# Altium schematic sheet Translators.SchDoc: FMC_ADC
size 420 x 297 mm; Author: G.Kasprowicz; CompanyName: WUT ISE; DrawnBy: G.Kasprowicz; Organization: WUT ISE; Address1: PW ISE; Address2: Nowowiejska 15/19 00-665 Warsaw; Address3: gkasprow@gmail.com; Revision: 2; SheetNumber: -; SheetTotal: -; ModifiedBy: -; CheckedDate: -; Title2: 100M_10B_16CHA_TDC; DivGrp: WUT ISE; Designer: G.Kasprowicz; ModifiedDate: -; ProjectName: Sensor Box
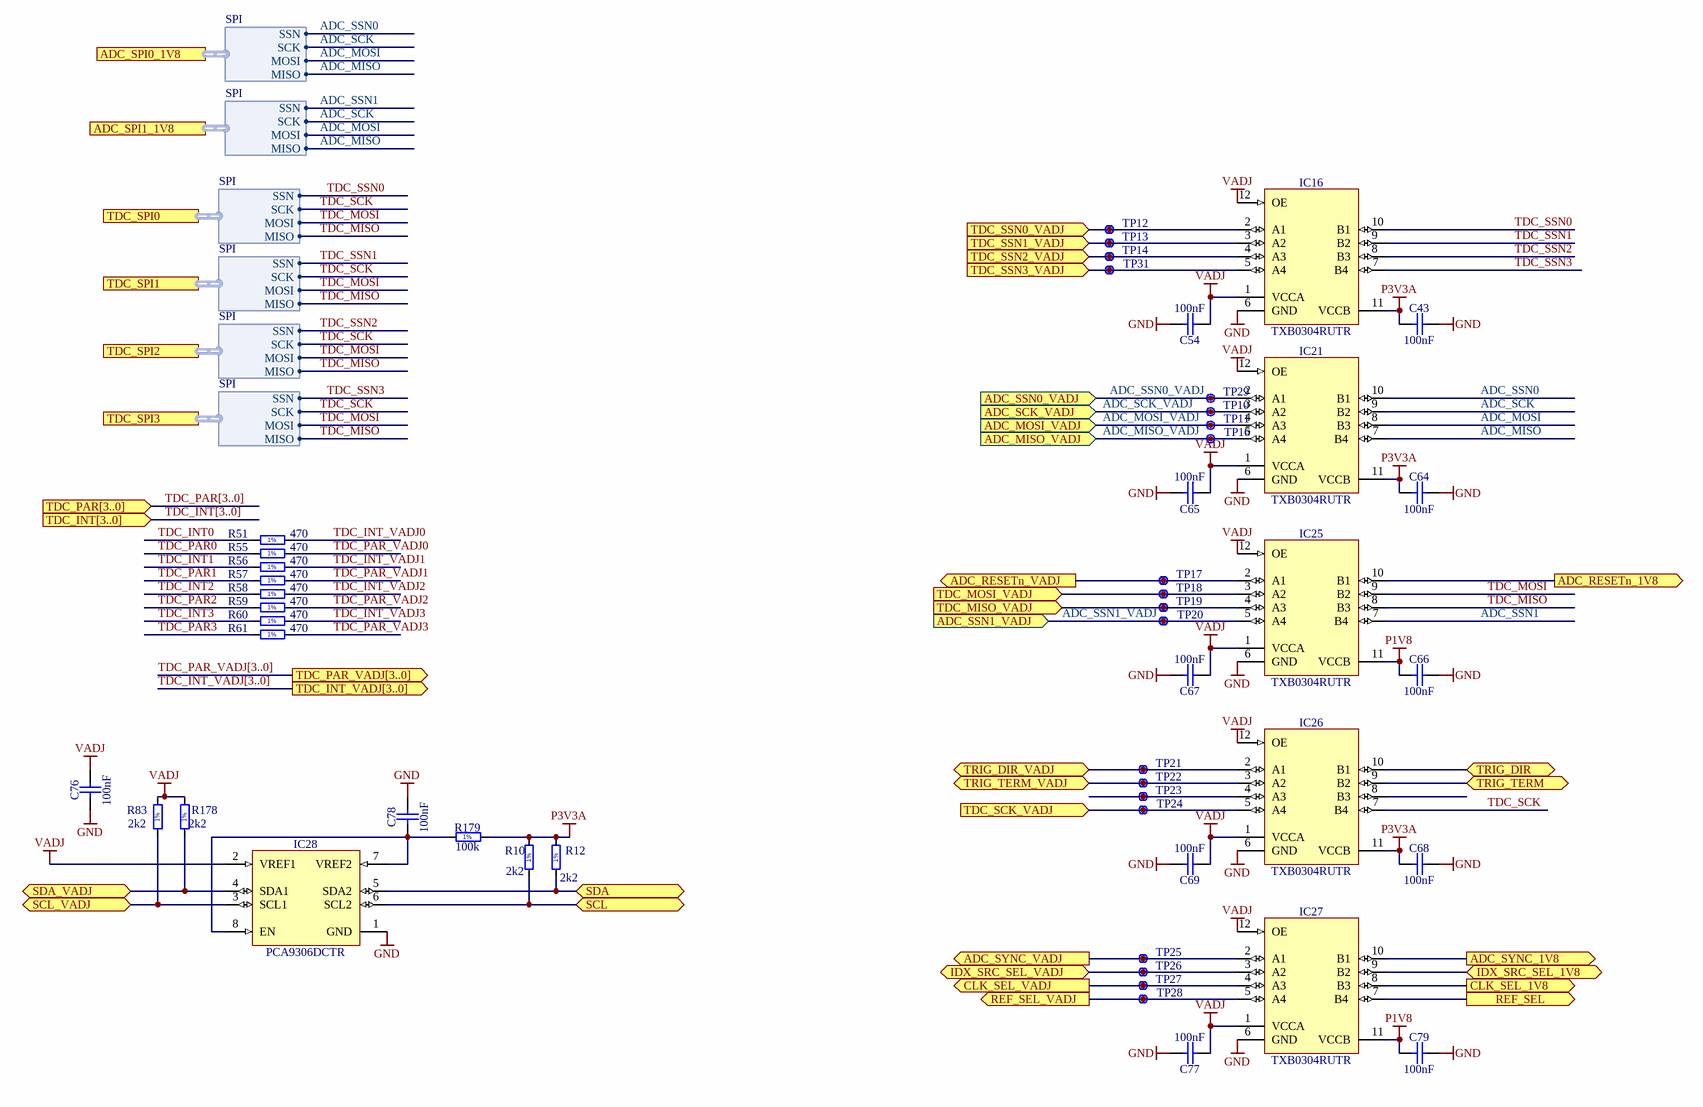
[diagram p0: Translators.SchDoc]

## Parts
C43  100nF  [CAPC0603X33N]
C54  100nF  [CAPC0603X33N]
C64  100nF  [CAPC0603X33N]
C65  100nF  [CAPC0603X33N]
C66  100nF  [CAPC0603X33N]
C67  100nF  [CAPC0603X33N]
C68  100nF  [CAPC0603X33N]
C69  100nF  [CAPC0603X33N]
C76  100nF  [CAPC0603X33N]
C77  100nF  [CAPC0603X33N]
C78  100nF  [CAPC0603X33N]
C79  100nF  [CAPC0603X33N]
IC16  TXB0304RUTR  [TEXAS_RUT (R-PUQFN-N12)]
IC21  TXB0304RUTR  [TEXAS_RUT (R-PUQFN-N12)]
IC25  TXB0304RUTR  [TEXAS_RUT (R-PUQFN-N12)]
IC26  TXB0304RUTR  [TEXAS_RUT (R-PUQFN-N12)]
IC27  TXB0304RUTR  [TEXAS_RUT (R-PUQFN-N12)]
IC28  PCA9306DCTR  [SOP65P400X130-8N]
R10  2k2  [RESC1005X40N]
R12  2k2  [RESC1005X40N]
R51  470  [RESC1005X40N]
R55  470  [RESC1005X40N]
R56  470  [RESC1005X40N]
R57  470  [RESC1005X40N]
R58  470  [RESC1005X40N]
R59  470  [RESC1005X40N]
R60  470  [RESC1005X40N]
R61  470  [RESC1005X40N]
R83  2k2  [RESC1005X40N]
R178  2k2  [RESC1005X40N]
R179  100k  [RESC1005X40N]
TP10  Test Point  [TPS62]  (value not drawn)
TP11  Test Point  [TPS62]  (value not drawn)
TP12  Test Point  [TPS62]  (value not drawn)
TP13  Test Point  [TPS62]  (value not drawn)
TP14  Test Point  [TPS62]  (value not drawn)
TP16  Test Point  [TPS62]  (value not drawn)
TP17  Test Point  [TPS62]  (value not drawn)
TP18  Test Point  [TPS62]  (value not drawn)
TP19  Test Point  [TPS62]  (value not drawn)
TP20  Test Point  [TPS62]  (value not drawn)
TP21  Test Point  [TPS62]  (value not drawn)
TP22  Test Point  [TPS62]  (value not drawn)
TP23  Test Point  [TPS62]  (value not drawn)
TP24  Test Point  [TPS62]  (value not drawn)
TP25  Test Point  [TPS62]  (value not drawn)
TP26  Test Point  [TPS62]  (value not drawn)
TP27  Test Point  [TPS62]  (value not drawn)
TP28  Test Point  [TPS62]  (value not drawn)
TP29  Test Point  [TPS62]  (value not drawn)
TP31  Test Point  [TPS62]  (value not drawn)

## Ports
ADC_MISO_VADJ (in), ADC_MOSI_VADJ (in), ADC_RESETn_1V8 (out), ADC_RESETn_VADJ (out), ADC_SCK_VADJ (in), ADC_SPI0_1V8 (harness SPI), ADC_SPI1_1V8 (harness SPI), ADC_SSN0_VADJ (in), ADC_SSN1_VADJ (in), ADC_SYNC_1V8 (out), ADC_SYNC_VADJ (out), CLK_SEL_1V8 (out), CLK_SEL_VADJ (out), IDX_SRC_SEL_1V8 (bidir), IDX_SRC_SEL_VADJ (bidir), REF_SEL (out), REF_SEL_VADJ (out), SCL (bidir), SCL_VADJ (bidir), SDA (bidir), SDA_VADJ (bidir), TDC_INT[3..0] (in), TDC_INT_VADJ[3..0] (out), TDC_MISO_VADJ (in), TDC_MOSI_VADJ (in), TDC_PAR[3..0] (in), TDC_PAR_VADJ[3..0] (out), TDC_SCK_VADJ (in), TDC_SPI0 (harness SPI), TDC_SPI1 (harness SPI), TDC_SPI2 (harness SPI), TDC_SPI3 (harness SPI), TDC_SSN0_VADJ (in), TDC_SSN1_VADJ (in), TDC_SSN2_VADJ (in), TDC_SSN3_VADJ (in), TRIG_DIR (bidir), TRIG_DIR_VADJ (bidir), TRIG_TERM (bidir), TRIG_TERM_VADJ (bidir)

## Harnesses
SPI: MISO, MOSI, SCK, SSN

## Nets
GND: C43.2 C54.2 C64.2 C65.2 C66.2 C67.2 C68.2 C69.2 C76.1 C77.2 C78.2 C79.2 IC16.6(GND) IC21.6(GND) IC25.6(GND) IC26.6(GND) IC27.6(GND) IC28.1(GND)
P1V8: C66.1 C79.1 IC25.11(VCCB) IC27.11(VCCB)
P3V3A: C43.1 C64.1 C68.1 IC16.11(VCCB) IC21.11(VCCB) IC26.11(VCCB) R10.2 R12.2 R179.2
VADJ: C54.1 C65.1 C67.1 C69.1 C76.2 C77.1 IC16.1(VCCA) IC16.12(OE) IC21.1(VCCA) IC21.12(OE) IC25.1(VCCA) IC25.12(OE) IC26.1(VCCA) IC26.12(OE) IC27.1(VCCA) IC27.12(OE) IC28.2(VREF1) R83.2 R178.2
ADC_MISO: IC21.7(B4) ; port ADC_SPI0_1V8.MISO, port ADC_SPI1_1V8.MISO
ADC_MISO_VADJ: IC21.5(A4) TP16.1 ; port ADC_MISO_VADJ
ADC_MOSI: IC21.8(B3) ; port ADC_SPI0_1V8.MOSI, port ADC_SPI1_1V8.MOSI
ADC_MOSI_VADJ: IC21.4(A3) TP11.1 ; port ADC_MOSI_VADJ
ADC_RESETn_1V8: IC25.10(B1) ; port ADC_RESETn_1V8
ADC_RESETn_VADJ: IC25.2(A1) TP17.1 ; port ADC_RESETn_VADJ
ADC_SCK: IC21.9(B2) ; port ADC_SPI0_1V8.SCK, port ADC_SPI1_1V8.SCK
ADC_SCK_VADJ: IC21.3(A2) TP10.1 ; port ADC_SCK_VADJ
ADC_SSN0: IC21.10(B1) ; port ADC_SPI0_1V8.SSN
ADC_SSN0_VADJ: IC21.2(A1) TP29.1 ; port ADC_SSN0_VADJ
ADC_SSN1: IC25.7(B4) ; port ADC_SPI1_1V8.SSN
ADC_SSN1_VADJ: IC25.5(A4) TP20.1 ; port ADC_SSN1_VADJ
ADC_SYNC_1V8: IC27.10(B1) ; port ADC_SYNC_1V8
ADC_SYNC_VADJ: IC27.2(A1) TP25.1 ; port ADC_SYNC_VADJ
CLK_SEL_1V8: IC27.8(B3) ; port CLK_SEL_1V8
CLK_SEL_VADJ: IC27.4(A3) TP27.1 ; port CLK_SEL_VADJ
IDX_SRC_SEL_1V8: IC27.9(B2) ; port IDX_SRC_SEL_1V8
IDX_SRC_SEL_VADJ: IC27.3(A2) TP26.1 ; port IDX_SRC_SEL_VADJ
REF_SEL: IC27.7(B4) ; port REF_SEL
REF_SEL_VADJ: IC27.5(A4) TP28.1 ; port REF_SEL_VADJ
SCL: IC28.6(SCL2) R10.1 ; port SCL
SCL_VADJ: IC28.3(SCL1) R83.1 ; port SCL_VADJ
SDA: IC28.5(SDA2) R12.1 ; port SDA
SDA_VADJ: IC28.4(SDA1) R178.1 ; port SDA_VADJ
TDC_INT0: R51.1
TDC_INT1: R56.1
TDC_INT2: R58.1
TDC_INT3: R60.1
TDC_INT_VADJ0: R51.2
TDC_INT_VADJ1: R56.2
TDC_INT_VADJ2: R58.2
TDC_INT_VADJ3: R60.2
TDC_MISO: IC25.8(B3) ; port TDC_SPI0.MISO, port TDC_SPI1.MISO, port TDC_SPI2.MISO, port TDC_SPI3.MISO
TDC_MISO_VADJ: IC25.4(A3) TP19.1 ; port TDC_MISO_VADJ
TDC_MOSI: IC25.9(B2) ; port TDC_SPI0.MOSI, port TDC_SPI1.MOSI, port TDC_SPI2.MOSI, port TDC_SPI3.MOSI
TDC_MOSI_VADJ: IC25.3(A2) TP18.1 ; port TDC_MOSI_VADJ
TDC_PAR0: R55.1
TDC_PAR1: R57.1
TDC_PAR2: R59.1
TDC_PAR3: R61.1
TDC_PAR_VADJ0: R55.2
TDC_PAR_VADJ1: R57.2
TDC_PAR_VADJ2: R59.2
TDC_PAR_VADJ3: R61.2
TDC_SCK: IC26.7(B4) ; port TDC_SPI0.SCK, port TDC_SPI1.SCK, port TDC_SPI2.SCK, port TDC_SPI3.SCK
TDC_SCK_VADJ: IC26.5(A4) TP24.1 ; port TDC_SCK_VADJ
TDC_SSN0: IC16.10(B1) ; port TDC_SPI0.SSN
TDC_SSN0_VADJ: IC16.2(A1) TP12.1 ; port TDC_SSN0_VADJ
TDC_SSN1: IC16.9(B2) ; port TDC_SPI1.SSN
TDC_SSN1_VADJ: IC16.3(A2) TP13.1 ; port TDC_SSN1_VADJ
TDC_SSN2: IC16.8(B3) ; port TDC_SPI2.SSN
TDC_SSN2_VADJ: IC16.4(A3) TP14.1 ; port TDC_SSN2_VADJ
TDC_SSN3: IC16.7(B4) ; port TDC_SPI3.SSN
TDC_SSN3_VADJ: IC16.5(A4) TP31.1 ; port TDC_SSN3_VADJ
TRIG_DIR: IC26.10(B1) ; port TRIG_DIR
TRIG_DIR_VADJ: IC26.2(A1) TP21.1 ; port TRIG_DIR_VADJ
TRIG_TERM: IC26.9(B2) ; port TRIG_TERM
TRIG_TERM_VADJ: IC26.3(A2) TP22.1 ; port TRIG_TERM_VADJ
NetC78_1: C78.1 IC28.7(VREF2) IC28.8(EN) R179.1
NetIC26_4: IC26.4(A3) TP23.1

Not connected (* = marked no-connect by the designer): IC26 8(B3)

## Buses and harness runs
bus TDC_INT[3..0] = port TDC_INT[3..0]
bus TDC_INT_VADJ[3..0] = port TDC_INT_VADJ[3..0]
bus TDC_PAR[3..0] = port TDC_PAR[3..0]
bus TDC_PAR_VADJ[3..0] = port TDC_PAR_VADJ[3..0]

## Notes on the sheet
- Project/Equipment
- Document
- Designer
- Drawn by
- Check.by
- Copyright WUT ISE 2018.
  This documentation describes Open Hardware and is licensed under the CERN OHL v.1.1. You may redistribute and modify this documentation under the terms of the CERN OHL v.1.1. (http://ohwr.org/CERNOHL). This documentation is distributed WITHOUT ANY EXPRESS OR IMPLIED WARRANTY, INCLUDING OF MERCHANTABILITY, SATISFACTORY QUALITY AND FITNESS FOR A PARTICULAR PURPOSE. Please see the CERN OHL v.1.1 for applicable conditions.
- Contact
- File
- Last Mod.
- Print Date
- Sheet
- Size
- A3
- of
- Rev
- (in symbol R0402_2K2_1%_0.0625W_100PPM) 1%
- (in symbol R0402_100K_1%_0.0625W_100PPM) 1%
- (in symbol R0402_470R_1%_0.0625W_100PPM) 1%

## Library data of the parts
C43 C54 C64-C69 C76-C79 = CC0201_100NF_6.3V_10%_X5R: Non-polarised capacitor; Manufacturer: GENERIC; Part Description: SMD Multilayer Chip Ceramic Capacitor; Manufacturer1 Part Number: 02016D104KAT2A; Tolerance: ±10%; Voltage: 6.3V; TC: X5R; Manufacturer Part Number: CC0201_100NF_6.3V_10%_X5R; Part Number: CC0201_100NF_6.3V_10%_X5R; Value: 100nF; Component Kind: Standard; Component Type: Standard; Pin Count: 2; Status: Not Recommended; Case: 0201; Mounted: Yes; Socket: No; SMD: Yes; Sense: No; Manufacturer1 Example: AVX; Manufacturer1 ComponentHeight: 0.33mm; HelpURL: \\cern.ch\dfs\Applications\Altium\Datasheets\CC0201_X5R_AVX.pdf; Author: CERN DEM JLC; CreateDate: 03.12.2007; LatestRevisionDate: 03.12.2007
IC16 IC21 IC25-IC27 = TXB0304RUTR: 4-bit Bidirectional Auto-direction Sensing Translator with Fully Symmetric 0.9V to 3.6V Range; Manufacturer: TEXAS INSTRUMENTS; PressFit: No; Bonding: No; Manufacturer Part Number: TXB0304RUTR; PackageDescription: SON, TEXAS RUT (R-PUQFN-N12), 0.50mm Pitch, 12-pin, 1.70mm W  X 2.00mm L X 0.55mm Height; Part Description: 4-bit Bidirectional Auto-direction Sensing Translator with Fully Symmetric 0.9V to 3.6V Range; Part Number: TXB0304RUTR; Component Kind: Standard; Component Type: Standard; Device: TXB0304RUTR; Pin Count: 12; Case: QFN12; Mounted: Yes; Socket: No; SMD: Yes; Sense: No; ComponentHeight: 0.55mm; Author: CERN DEM JLC; HelpURL: \\cern.ch\dfs\Applications\Altium\Datasheets\TXB0304RUTR.pdf; CreateDate: 27.10.2014; LatestRevisionDate: 28.10.2014
IC28 = PCA9306DCTR: Dual Bidirectional I2C Bus And SMBus Voltage-Level Translator; Manufacturer: TEXAS INSTRUMENTS; Table: Analog & Interface; Part Number: PCA9306DCTR; Component Kind: Standard; Component Type: Standard; Device: PCA9306DCTR; PackageDescription: SOP, 0.65mm, Pitch; 8 Pin, 2.80mm W X 2.95mm L X 1.30mm H Body, PC Medium Density; Part Description: Dual Bidirectional I2C Bus And SMBus Voltage-Level Translator; Manufacturer Part Number: PCA9306DCTR; Pin Count: 8; Case: SSOP8; Mounted: Yes; Socket: No; SMD: Yes; ComponentHeight: 1.3mm; Author: CERN DEM JLC; HelpURL: \\cern.ch\dfs\Applications\Altium\Datasheets\PCA9306DCTR.pdf; CreateDate: 2013-02-25; LatestRevisionDate: 2013-02-25
R10 R12 R83 R178 = R0402_2K2_1%_0.0625W_100PPM: Resistor - 1%; Part Description: General Purpose Thick Film Chip Resistor; Manufacturer: GENERIC; Manufacturer1 Part Number: 232270672202L; TC: ±100ppm/°C; Table: Resistors SMD; Part Number: R0402_2K2_1%_0.0625W_100PPM; Component Kind: Standard; Component Type: Standard; Pin Count: 2; Value: 2k2; Status: Not recommended; Power: 0.0625W; Tolerance: ±1%; Manufacturer Part Number: R0402_2K2_1%_0.0625W_100PPM; Case: 0402; Mounted: Yes; Socket: No; SMD: Yes; Manufacturer1 Example: YAGEO PHYCOMP; Manufacturer1 ComponentHeight: 0.4mm; HelpURL: \\cern.ch\dfs\Applications\Altium\Datasheets\R0402_Phycomp_RC0402.pdf; Author: CERN DEM JLC; CreateDate: 2007-12-03; LatestRevisionDate: 2012-10-17
R51 R55-R61 = R0402_470R_1%_0.0625W_100PPM: Resistor - 1%; Part Description: General Purpose Thick Film Chip Resistor; Manufacturer: GENERIC; Manufacturer1 Part Number: 232270674701L; TC: ±100ppm/°C; PressFit: No; Part Number: R0402_470R_1%_0.0625W_100PPM; Component Kind: Standard; Component Type: Standard; Pin Count: 2; Value: 470; Status: Not Recommended; Power: 0.0625W; Tolerance: ±1%; Manufacturer Part Number: R0402_470R_1%_0.0625W_100PPM; Case: 0402; Mounted: Yes; Sense: No; Socket: No; SMD: Yes; Manufacturer1 Example: YAGEO PHYCOMP; Manufacturer1 ComponentHeight: 0.4mm; HelpURL: \\cern.ch\dfs\Applications\Altium\Datasheets\R0402_Phycomp_RC0402.pdf; Author: CERN DEM JLC; CreateDate: 03.12.2007; LatestRevisionDate: 17.10.2012
R179 = R0402_100K_1%_0.0625W_100PPM: Resistor - 1%; Part Description: General Purpose Thick Film Chip Resistor; Manufacturer: GENERIC; Manufacturer1 Part Number: 232270671004L; TC: ±100ppm/°C; Table: Resistors SMD; Part Number: R0402_100K_1%_0.0625W_100PPM; Component Kind: Standard; Component Type: Standard; Pin Count: 2; Value: 100k; Status: Not recommended; Power: 0.0625W; Tolerance: ±1%; Manufacturer Part Number: R0402_100K_1%_0.0625W_100PPM; Case: 0402; Mounted: Yes; Socket: No; SMD: Yes; Manufacturer1 Example: YAGEO PHYCOMP; Manufacturer1 ComponentHeight: 0.4mm; HelpURL: \\cern.ch\dfs\Applications\Altium\Datasheets\R0402_Phycomp_RC0402.pdf; Author: CERN DEM JLC; CreateDate: 2007-12-03; LatestRevisionDate: 2012-10-17
TP10-TP14 TP16-TP29 TP31 = SMD_PAD_0.62X0.62MM: Part Description: 0.62mm x 0.62mm PCB Copper Area (SMD Test Point); Mounted: No; Part Number: SMD_PAD_0.62X0.62MM; Component Kind: Standard (No BOM); Component Type: Standard (No BOM); Pin Count: 1; Family: Test Point; Socket: No; SMD: Yes; Sense: No; Status: None; ComponentHeight: 0mm; HelpURL: Undefined; Author: CERN DEM JLC; CreateDate: 12.01.2008; LatestRevisionDate: 12.01.2008; PackageDescription: 0.62mm x 0.62mm PCB Copper Area (SMD Test Point)